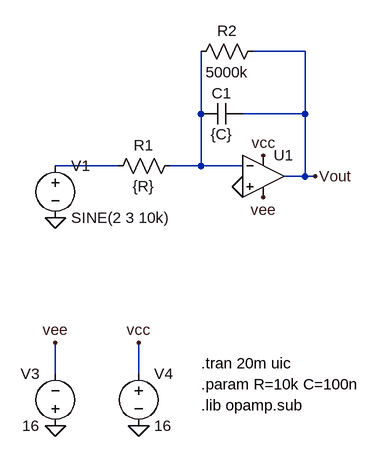
[diagram p0: schematic HW6.asc]
HW6.asc, the LTspice schematic file:
Version 4.1
SHEET 1 1364 868
WIRE -48 272 -128 272
WIRE -208 368 -208 272
WIRE -48 368 -48 272
WIRE -48 368 -144 368
WIRE -336 448 -432 448
WIRE -208 448 -208 368
WIRE -208 448 -256 448
WIRE -144 448 -208 448
WIRE -48 464 -48 368
WIRE -48 464 -80 464
WIRE -32 464 -48 464
WIRE -432 768 -432 720
WIRE -304 768 -304 720
FLAG -432 528 0
FLAG -32 464 Vout
FLAG -112 496 vee
FLAG -112 432 vcc
FLAG -144 480 0
FLAG -432 848 0
FLAG -304 848 0
FLAG -432 720 vee
FLAG -304 720 vcc
SYMBOL voltage -432 432 R0
WINDOW 123 0 0 Left 0
WINDOW 39 0 0 Left 0
SYMATTR InstName V1
SYMATTR Value SINE(2 3 10k)
SYMBOL res -240 432 R90
WINDOW 0 0 56 VBottom 2
WINDOW 3 32 56 VTop 2
SYMATTR InstName R1
SYMATTR Value {R}
SYMBOL voltage -432 864 R180
WINDOW 0 24 96 Left 2
WINDOW 3 24 16 Left 2
WINDOW 123 0 0 Left 0
WINDOW 39 0 0 Left 0
SYMATTR InstName V3
SYMATTR Value 16
SYMBOL voltage -304 752 R0
WINDOW 123 0 0 Left 0
WINDOW 39 0 0 Left 0
SYMATTR InstName V4
SYMATTR Value 16
SYMBOL OpAmps\\UniversalOpAmp2 -112 464 R0
SYMATTR InstName U1
SYMBOL cap -208 352 M90
WINDOW 0 0 32 VBottom 2
WINDOW 3 32 32 VTop 2
SYMATTR InstName C1
SYMATTR Value {C}
SYMBOL res -112 256 R90
WINDOW 0 0 56 VBottom 2
WINDOW 3 32 56 VTop 2
SYMATTR InstName R2
SYMATTR Value 5000k
TEXT -208 752 Left 2 !.tran 20m uic
TEXT -208 784 Left 2 !.param R=10k C=100n
TEXT -208 816 Left 2 !.lib opamp.sub

The netlist it stands for:
* HW6.asc
V1 N002 0 SINE(2 3 10k)
R1 N001 N002 {R}
V3 0 vee 16
V4 vcc 0 16
X§U1 0 N001 vcc vee Vout level2 Avol=1Meg GBW=10Meg Slew=10Meg Ilimit=25m Rail=0 Vos=0 En=0 Enk=0 In=0 Ink=0 Rin=500Meg  ; pins In+ In- V+ V- OUT
C1 N001 Vout {C}
R2 Vout N001 5000k
.tran 20m uic
.param R=10k C=100n
.lib opamp.sub
.lib UniversalOpAmp2.lib
.backanno
.end

* Results of the author's LTspice run, read from the files saved beside the schematic
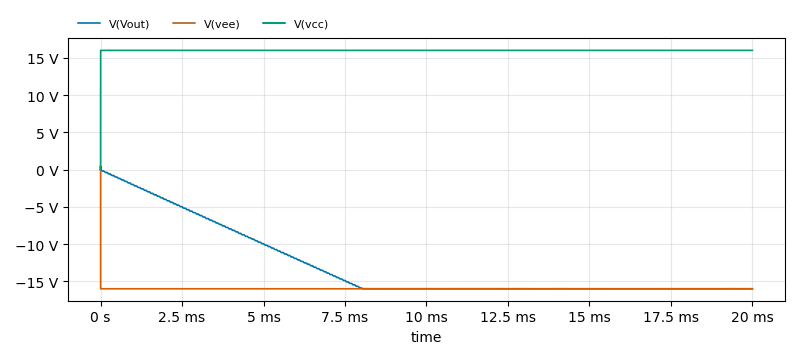
[diagram p1: Transient Analysis of HW6.asc, plotted from the saved traces]
* Transient Analysis, 1 run:
*   V(Vout): min -16 V, max 480.7 mV, average -12.8 V, rms 13.7 V, last -16 V
*   V(vee): min -16 V, max 0 V, average -16 V, rms 16 V, last -16 V
*   V(vcc): min 0 V, max 16 V, average 16 V, rms 16 V, last 16 V